# EAGLE schematic schemantic (EAGLE 9.4.2)
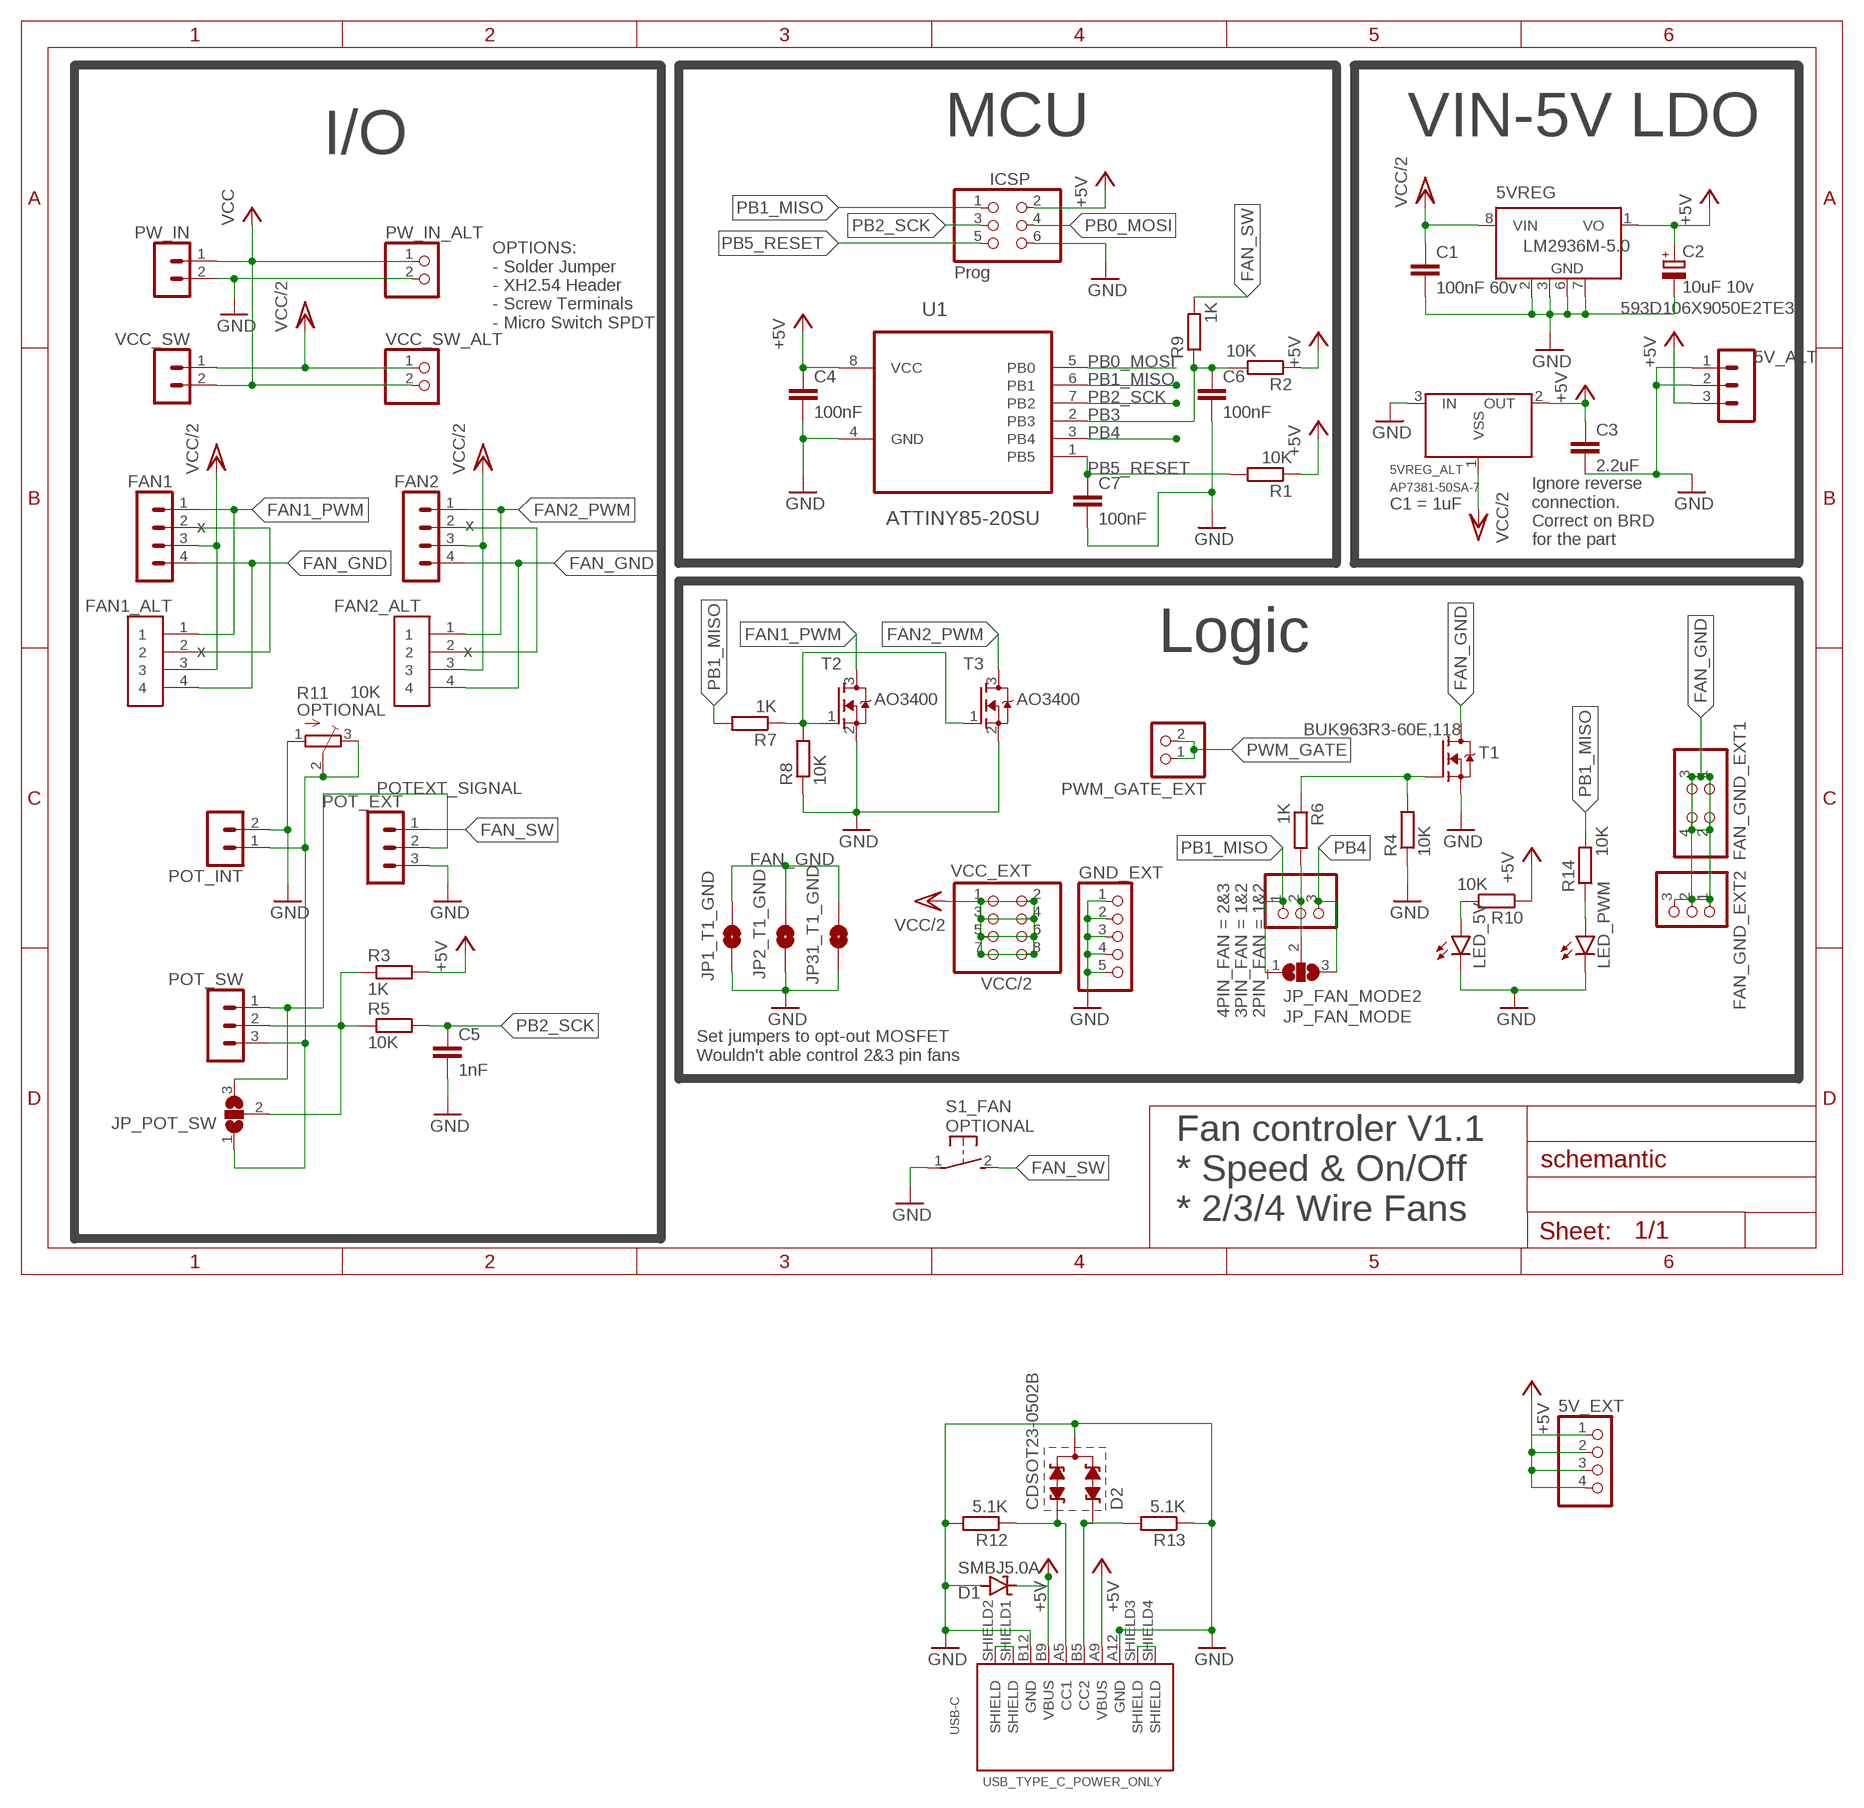
[diagram p0: schematic, sheet 1]

## Parts
5V_ALT  B3B-XH-2  [B3B-XH-A]
5V_EXT  PINHD-1X4  [1X04]
5VREG  LM2936M-5.0  [SO08]
5VREG_ALT  AP7381-50SA-7  XC6206SOT-23  [XC6206_SOT-23]
C1  100nF 60v  C-EUC1206  [C1206]
C2  10uF 10v  CPOL-EUSMCE  [SMC_E]
C3  2.2uF  C-EUC0603  [C0603]
C4  100nF  C-EUC0603  [C0603]
C5  1nF  C-EUC0603  [C0603]
C6  100nF  C-EUC0603  [C0603]
C7  100nF  C-EUC0603  [C0603]
D1  SMBJ5.0A  SUPPRESSOR-SMBJ  [SMBJ]
D2  CDSOT23-0502B  [SOT23]
FAN1  FAN1  B4P-VH  [B4P-VH]
FAN1_ALT  1X4-BIG  [1X04-BIG]
FAN2  FAN1  B4P-VH  [B4P-VH]
FAN2_ALT  1X4-BIG  [1X04-BIG]
FAN_GND_EXT1  PINHD-2X2  [2X02]
FAN_GND_EXT2  PINHD-1X3  [1X03]
GND_EXT  PINHD-1X5  [1X05]
ICSP  Prog  PINHD-2X3  [2X03]
JP1_T1_GND  JUMPER-SMT_2_NO_NO-SILK  [SMT-JUMPER_2_NO_NO-SILK]
JP2_T1_GND  JUMPER-SMT_2_NO_NO-SILK  [SMT-JUMPER_2_NO_NO-SILK]
JP31_T1_GND  JUMPER-SMT_2_NO_NO-SILK  [SMT-JUMPER_2_NO_NO-SILK]
JP_FAN_MODE  DC_COM_PWM  SJ2W  [SJ_2]
JP_FAN_MODE2  PINHD-1X3  [1X03]
JP_POT_SW  SJ2W  [SJ_2]
LED_5V  LEDCHIPLED_0805  [CHIPLED_0805]
LED_PWM  LEDCHIPLED_0805  [CHIPLED_0805]
POT_EXT  POT_EXT  B3B-XH-2  [B3B-XH-A]
POT_INT  POT_INT  B2B-XH-2  [B2B-XH-A]
POT_SW  POT_SW  B3B-XH-2  [B3B-XH-A]
PW_IN  Power In  B2P-VH  [B2P-VH]
PW_IN_ALT  PINHD-1X2  [1X02]
PWM_GATE_EXT  PINHD-1X2  [1X02]
R1  10K  R-EU_R0603  [R0603]
R2  10K  R-EU_R0603  [R0603]
R3  1K  R-EU_R0603  [R0603]
R4  10K  R-EU_R0603  [R0603]
R5  10K  R-EU_R0603  [R0603]
R6  1K  R-EU_R0603  [R0603]
R7  1K  R-EU_R0603  [R0603]
R8  10K  R-EU_R0603  [R0603]
R9  1K  R-EU_R0603  [R0603]
R10  10K  R-EU_R0603  [R0603]
R11  10K  TRIM_EU-3223W  [3223W]
R12  5.1K  R-EU_R0603  [R0603]
R13  5.1K  R-EU_R0603  [R0603]
R14  10K  R-EU_R0603  [R0603]
S1_FAN  DTSM-3  [DTSM-3]
T1  BUK963R3-60E,118  MOSFET-N-D2PAK  [D2PAK_TO263]
T2  AO3400  MOSFET-NREFLOW  [SOT23]
T3  AO3400  MOSFET-NREFLOW  [SOT23]
U1  ATTINY85-20SU  [SOIC127P798X216-8N]
USB-C  USB_TYPE_C_POWER_ONLY  [USB_TYPE_C_POWER_ONLY]
VCC_EXT  PINHD-2X4  [2X04]
VCC_SW  Power SW  B2P-VH  [B2P-VH]
VCC_SW_ALT  PINHD-1X2  [1X02]

## Nets
+5V: 5V_ALT.3 5V_EXT.1 5V_EXT.2 5V_EXT.3 5V_EXT.4 5VREG.1(VO) 5VREG_ALT.2(OUT) C2.+ C3.1 C4.1 D1.C ICSP.2 R1.1 R2.1 R3.2 R10.1 U1.8(VCC) USB-C.A9(VBUS) USB-C.B9(VBUS)
FAN1_LATCH: FAN1.2 FAN1_ALT.2
FAN1_PWM: FAN1.1 FAN1_ALT.1 T2.3(D)
FAN2_LATCH: FAN2.2 FAN2_ALT.2
FAN2_PWM: FAN2.1 FAN2_ALT.1 T3.3(D)
FAN_GND: FAN1.4 FAN1_ALT.4 FAN2.4 FAN2_ALT.4 FAN_GND_EXT1.1 FAN_GND_EXT1.2 FAN_GND_EXT1.3 FAN_GND_EXT1.4 FAN_GND_EXT2.1 FAN_GND_EXT2.2 FAN_GND_EXT2.3 JP1_T1_GND.2 JP2_T1_GND.2 JP31_T1_GND.2 T1.2(D)
FAN_SW: POT_EXT.1 R9.2 S1_FAN.2
GND: 5V_ALT.1 5V_ALT.2 5VREG.2(GND) 5VREG.3(GND) 5VREG.6(GND) 5VREG.7(GND) 5VREG_ALT.3(IN) C1.2 C2.- C3.2 C4.2 C5.2 C6.2 C7.2 D1.A D2.3 GND_EXT.1 GND_EXT.2 GND_EXT.3 GND_EXT.4 GND_EXT.5 ICSP.6 JP1_T1_GND.1 JP2_T1_GND.1 JP31_T1_GND.1 LED_5V.C LED_PWM.C POT_EXT.3 POT_INT.2 PW_IN.2 PW_IN_ALT.2 R4.1 R8.1 R11.1(A) R12.2 R13.1 S1_FAN.1 T1.3(S) T2.2(S) T3.2(S) U1.4(GND) USB-C.A12(GND) USB-C.B12(GND)
JP1_COM: JP_FAN_MODE2.2 JP_FAN_MODE.2 R6.2
LED1_ANODE: LED_5V.A R10.2
LED2_ANODE: LED_PWM.A R14.1
N$1: USB-C.SHIELD1(SHIELD) USB-C.SHIELD2(SHIELD)
N$2: USB-C.SHIELD3(SHIELD) USB-C.SHIELD4(SHIELD)
PB0_MOSI: ICSP.4 U1.5(PB0)
PB1_MISO: ICSP.1 JP_FAN_MODE2.1 JP_FAN_MODE.1 R7.2 R14.2 U1.6(PB1)
PB2_SCK: C5.1 ICSP.3 R5.2 U1.7(PB2)
PB3: C6.1 R2.2 R9.1 U1.2(PB3)
PB4: JP_FAN_MODE2.3 JP_FAN_MODE.3 U1.3(PB4)
PB5_RESET: C7.1 ICSP.5 R1.2 U1.1(PB5)
POTEXT_SIGNAL: JP_POT_SW.3 POT_EXT.2 POT_SW.1
POTINT_SIGNAL: JP_POT_SW.1 POT_INT.1 POT_SW.3 R11.2(S) R11.3(E)
POTSW_COM: JP_POT_SW.2 POT_SW.2 R3.1 R5.1
PWM_GATE: PWM_GATE_EXT.1 PWM_GATE_EXT.2 R7.1 R8.2 T2.1(G) T3.1(G)
T1_GATE: R4.2 R6.1 T1.1(G)
USBC_CC1: D2.2 R12.1 USB-C.A5(CC1)
USBC_CC2: D2.1 R13.2 USB-C.B5(CC2)
VCC: PW_IN.1 PW_IN_ALT.1 VCC_SW.2 VCC_SW_ALT.2
VCC/2: 5VREG.8(VIN) 5VREG_ALT.1(VSS) C1.1 FAN1.3 FAN1_ALT.3 FAN2.3 FAN2_ALT.3 VCC_EXT.1 VCC_EXT.2 VCC_EXT.3 VCC_EXT.4 VCC_EXT.5 VCC_EXT.6 VCC_EXT.7 VCC_EXT.8 VCC_SW.1 VCC_SW_ALT.1

## Notes on the sheet
- I/O | MCU | VIN-5V LDO
- OPTIONS:
  - Solder Jumper
  - XH2.54 Header
  - Screw Terminals
  - Micro Switch SPDT
- x | x
- Ignore reverse
  connection.
  Correct on BRD
  for the part
- Logic
- x | x
- Set jumpers to opt-out MOSFET
  Wouldn't able control 2&3 pin fans
- Fan controler V1.1
  * Speed & On/Off
  * 2/3/4 Wire Fans

## Library data of the parts
5V_ALT POT_EXT POT_SW = con-jst-xh:B3B-XH: JST XH series header 2.50mm pitch disconnectable crimp style connectors, vertical (side entry type), 3 pins
5V_EXT = pinhead:PINHD-1X4: PIN HEADER
5VREG = national-semiconductor:LM2936M?*: Ultra-Low Quiescent Current LDO Voltage Regulator Source: Data sheet <http://www.national.com/ds/LM/LM2936.pdf>; MF: NATIONAL SEMICONDUCTOR; MPN: LM2936HVMA-5.0/NOPB; OC_FARNELL: 9494421; OC_NEWARK: 41K4515
5VREG_ALT = Voltage Regulator:XC6206: XC6206P , linear regulator. Producted by TOREX.Co Store Information: EXCEL device corporation http://www.excel-d.com/access/index.html; C1: 1uF
C1 C3-C7 = rcl:C-EU: CAPACITOR, European symbol; SPICEPREFIX: C
C2 = rcl:CPOL-EU: POLARIZED CAPACITOR, European symbol; MODEL: 593D106X9050E2TE3; SPICEPREFIX: C
D1 = diode:SUPPRESSOR-: Suppressor diode
D2 = diode:CDSOT23-0502B: TVS DIODE
FAN1 FAN2 = con-jst-vh:B4P-VH: JST VH Series header 3.96mm pitch disconnectable crimp style connectors, vertical (side entry type), 4 pins
FAN1_ALT FAN2_ALT = adafruit:1X4: 4-pin connector
FAN_GND_EXT1 = pinhead:PINHD-2X2: PIN HEADER
FAN_GND_EXT2 = pinhead:PINHD-1X3: PIN HEADER
GND_EXT = pinhead:PINHD-1X5: PIN HEADER
ICSP = pinhead:PINHD-2X3: PIN HEADER
JP1_T1_GND JP2_T1_GND JP31_T1_GND = SparkFun-Jumpers:JUMPER-SMT_2_NO: Normally open jumper This jumper has two pads in close proximity to each other. Apply solder to close the connection. Round pads are easier to solder for beginners, but are a lot larger. SparkFun Product that uses the round pads: SparkFun EL Sequencer <https://www.sparkfun.com/products/12781>
JP_FAN_MODE JP_POT_SW = jumper:SJ2W: SMD solder JUMPER
JP_FAN_MODE2 = adafruit:PINHD-1X3: PIN HEADER; 2PIN_FAN: 1&2; 3PIN_FAN: 1&2; 4PIN_FAN: 2&3
LED_5V LED_PWM = led:LED: LED OSRAM: - CHIPLED LG R971, LG N971, LY N971, LG Q971, LY Q971, LO R971, LY R971 LH N974, LH R974 LS Q976, LO Q976, LY Q976 LO Q996 - Hyper CHIPLED LW Q18S LB Q993, LB Q99A, LB R99A - SideLED LS A670, LO A670, LY A670, LG A670, LP A670 LB A673, LV A673, LT A673, LW A673 LH A674 LY A675 LS A676, LA A676, LO A676, LY A676, LW A676 LS A679, LY A679, LG A679 - Hyper Micro SIDELED® LS Y876, LA Y876, LO Y876, LY Y876 LT Y87S - SmartLED LW L88C, LW L88S LB L89C, LB L89S, LG L890 LS L89K, LO L89K, LY L89K LS L896, LA L896, LO L896, LY L896 - TOPLED LS T670, LO T670, LY T670, LG T670, LP T670 LSG T670, LSP T670, LSY T670, LOP T670, LYG T670 LG T671, LOG T671, LSG T671 LB T673, LV T673, LT T673, LW T673 LH T674 LS T676, LA T676, LO T676, LY T676, LB T676, LH T676, LSB T676, LW T676 LB T67C, LV T67C, LT T67C, LS T67K, LO T67K, LY T67K, LW E67C LS E67B, LA E67B, LO E67B, LY E67B, LB E67C, LV E67C, LT E67C LW T67C LS T679, LY T679, LG T679 LS T770, LO T770, LY T770, LG T770, LP T770 LB T773, LV T773, LT T773, LW T773 LH T774 LS E675, LA E675, LY E675, LS T675 LS T776, LA T776, LO T776, LY T776, LB T776 LHGB T686 LT T68C, LB T68C - Hyper Mini TOPLED® LB M676 - Mini TOPLED Santana® LG M470 LS M47K, LO M47K, LY M47K Source: http://www.osram.convergy.de LUXEON: - LUMILED® LXK2-PW12-R00, LXK2-PW12-S00, LXK2-PW14-U00, LXK2-PW14-V00 LXK2-PM12-R00, LXK2-PM12-S00, LXK2-PM14-U00 LXK2-PE12-Q00, LXK2-PE12-R00, LXK2-PE12-S00, LXK2-PE14-T00, LXK2-PE14-U00 LXK2-PB12-K00, LXK2-PB12-L00, LXK2-PB12-M00, LXK2-PB14-N00, LXK2-PB14-P00, LXK2-PB14-Q00 LXK2-PR12-L00, LXK2-PR12-M00, LXK2-PR14-Q00, LXK2-PR14-R00 LXK2-PD12-Q00, LXK2-PD12-R00, LXK2-PD12-S00 LXK2-PH12-R00, LXK2-PH12-S00 LXK2-PL12-P00, LXK2-PL12-Q00, LXK2-PL12-R00 Source: www.luxeon.com KINGBRIGHT: KA-3528ASYC Source: www.kingbright.com
POT_INT = con-jst-xh:B2B-XH: JST XH series header 2.50mm pitch disconnectable crimp style connectors, vertical (side entry type), 2 pins
PW_IN VCC_SW = con-jst-vh:B2P-VH: JST VH Series header 3.96mm pitch disconnectable crimp style connectors, vertical (side entry type), 2 pins
PW_IN_ALT PWM_GATE_EXT VCC_SW_ALT = pinhead:PINHD-1X2: PIN HEADER
R1-R10 R12-R14 = rcl:R-EU_: RESISTOR, European symbol; SPICEPREFIX: R
R11 = pot:TRIM_EU-: POTENTIOMETER; OPTIONAL: YES
S1_FAN = switch-tact:DTSM-3; OPTIONAL: YES
T1 = we-transistor:MOSFET-N: N-Channel MOSFET SOT23 N-Chn MOSFET TSM3404, TSM240N03 (Vgs>=+/-20V, Vds<=30V, Id>=3A + Rds<=0.05Ohm @ Vgs=4.5V) BSS138 (Vgs>=+/-20V, Vds<=40V, Id>=0.2A + Rds<=3Ohm @ Vgs=4.5V) SOT223 Low Side Switch with Protection (Infineon) BSP76 (Vin=0...10V, Vds<=42V, Id=1.4A + Rds=0.2Ohm @ Vin=5V) BSP77 (Vin=0...10V, Vds<=42V, Id=2.2A + Rds=0.1Ohm @ Vin=5V) D²Pak Low Side Switch with Protection (Infineon) BTS117TC (Vin=0...10V, Vds<=60V, Id=3.5A + Rds=0.12Ohm @ Vin=5V) BTS133TC (Vin=0...10V, Vds<=60V, Id=7A + Rds=0.06Ohm @ Vin=5V) BTS141TC (Vin=0...10V, Vds<=60V, Id=12A + Rds=0.03Ohm @ Vin=5V) BTS3018TC (Vin=0...10V, Vds<=60V, Id=6A + Rds=0.02Ohm @ Vin=5V); ALT1: IRF2805SPbF; OLD: SQM110P06-8m9L_GE3
T2 T3 = adafruit:MOSFET-N: N-Channel Mosfet 2N7002E - 60V 260mA SOT23 [Digikey: 2N7002ET1GOSTR-ND] - REEL BSH103 - 30V 850mA SOT23 [Digikey: 568-5013-1-ND]; SPICEPREFIX: J
U1 = Atmel_By_element14_Batch_1-00:ATTINY85-20SU: 8-bit Microcontroller with In-System Programmable Flash; MPN: ATTINY85-20SU; OC_FARNELL: 1455164; OC_NEWARK: 58M3797; PACKAGE: SOIC-8; SUPPLIER: Atmel
USB-C = USB_C_FEMALE_POWER:USB_TYPE_C_POWER_ONLY: Micro USB Type C 3.1 Female SMT Connector - Power Only - High Current; CURRENT: HIGH; SOCKET: FEMALE
VCC_EXT = pinhead:PINHD-2X4: PIN HEADER